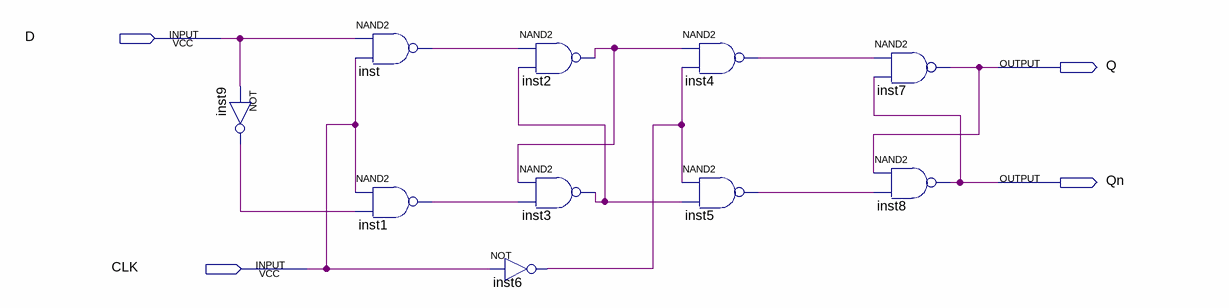
[diagram p0: schematic sheet]
// Quartus schematic msdff.bdf as structural Verilog: 10 symbols, 4 pins
module msdff (
  input  D,
  input  CLK,
  output Q,
  output Qn
);

  wire inst1_out, inst2_out, inst3_out, inst4_out, inst5_out, inst6_out, inst9_out, inst_out;

  not inst9 (inst9_out, D);
  nand inst (inst_out, D, CLK);
  nand inst1 (inst1_out, CLK, inst9_out);
  not inst6 (inst6_out, CLK);
  nand inst2 (inst2_out, inst_out, inst3_out);
  nand inst3 (inst3_out, inst2_out, inst1_out);
  nand inst4 (inst4_out, inst2_out, inst6_out);
  nand inst5 (inst5_out, inst6_out, inst3_out);
  nand inst7 (Q, inst4_out, Qn);
  nand inst8 (Qn, Q, inst5_out);
endmodule
